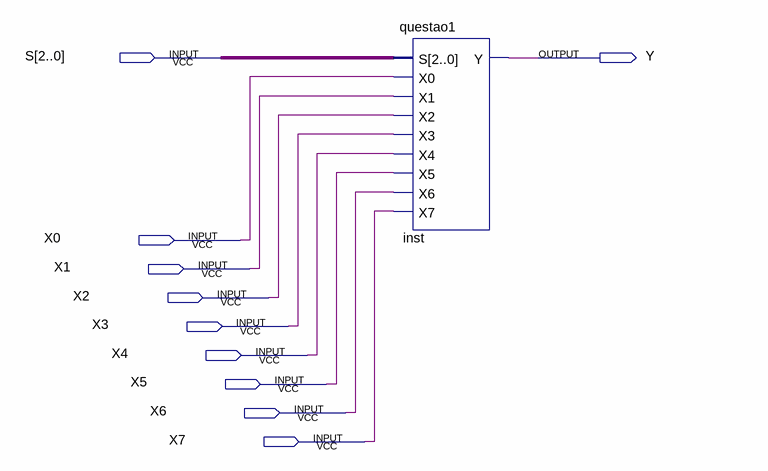
[diagram p0: schematic sheet]
// Quartus schematic quest2.bdf as structural Verilog: 1 symbols, 10 pins
module quest2 (
  input  [2:0] S,
  input  X0,
  input  X1,
  input  X2,
  input  X3,
  input  X4,
  input  X5,
  input  X6,
  input  X7,
  output Y
);

  questao1 inst (.S(S), .X0(X0), .X1(X1), .X2(X2), .X3(X3), .X4(X4), .X5(X5), .X6(X6), .X7(X7), .Y(Y));
endmodule
